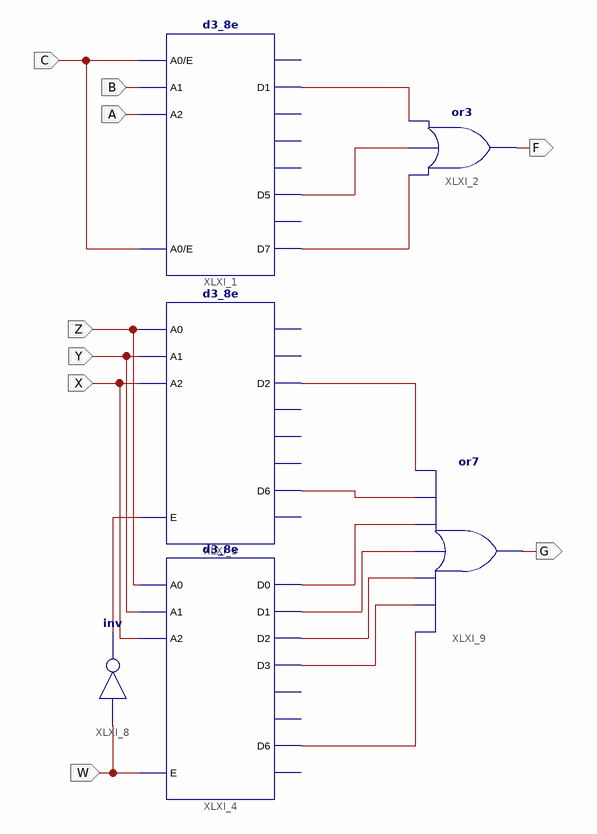
[diagram p0: schematic sheet 1]
// Xilinx ISE schematic schematic.sch (spartan3e) as structural Verilog: 6 symbols, 9 ports
module schematic (
  input  A,
  input  B,
  input  C,
  input  Z,
  input  Y,
  input  X,
  input  W,
  output F,
  output G
);

  wire XLXN_1, XLXN_2, XLXN_3, XLXN_16, XLXN_17, XLXN_20, XLXN_21, XLXN_22, XLXN_23, XLXN_24, XLXN_26;

  d3_8e XLXI_1 (.A0(C), .A1(B), .A2(A), .E(C), .D1(XLXN_1), .D5(XLXN_2), .D7(XLXN_3));  // open: D0, D2, D3, D4, D6
  or XLXI_2 (F, XLXN_3, XLXN_2, XLXN_1);
  d3_8e XLXI_3 (.A0(Z), .A1(Y), .A2(X), .E(XLXN_16), .D2(XLXN_17), .D6(XLXN_26));  // open: D0, D1, D3, D4, D5, D7
  d3_8e XLXI_4 (
    .A0(Z), .A1(Y), .A2(X), .E(W), .D0(XLXN_20), .D1(XLXN_21), .D2(XLXN_22), .D3(XLXN_23), .D6(XLXN_24));  // open: D4, D5, D7
  not XLXI_8 (XLXN_16, W);
  or XLXI_9 (G, XLXN_24, XLXN_23, XLXN_22, XLXN_21, XLXN_20, XLXN_26, XLXN_17);
endmodule
